# Altium schematic sheet KeyBesselEsquematico.SchDoc
size A4
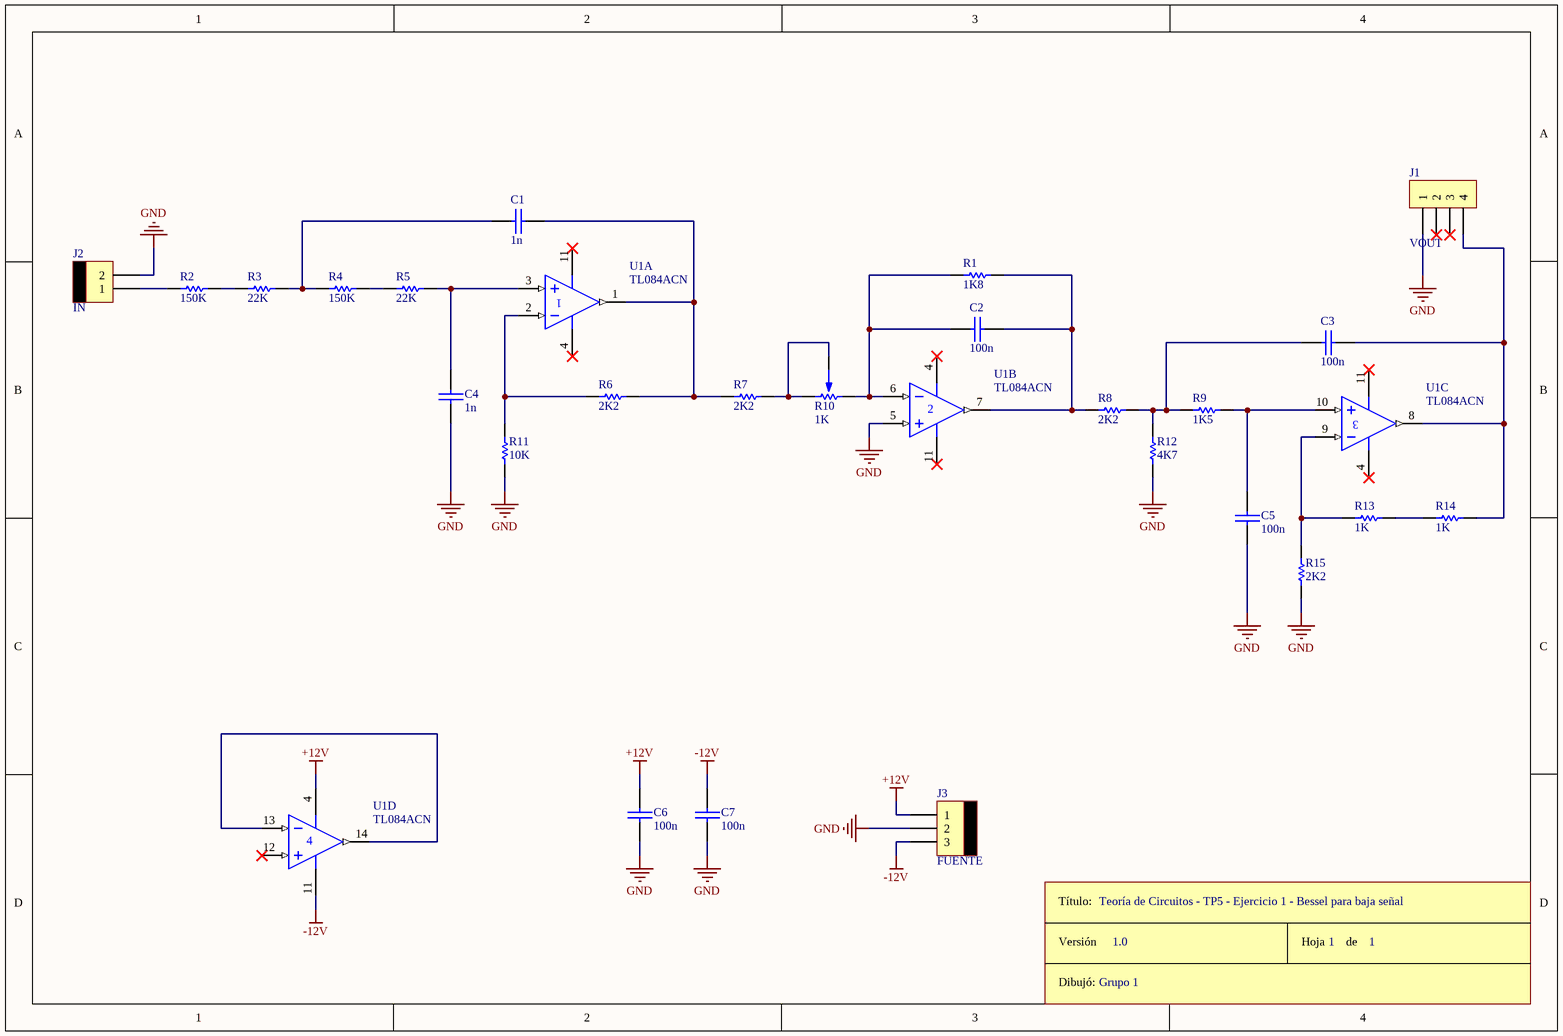
[diagram p0: KeyBesselEsquematico.SchDoc]

## Parts
C1  1n  [CAP100]
C2  100n  [CAP100]
C3  100n  [CAP100]
C4  1n  [CAP100]
C5  100n  [CAP100]
C6  100n  [CAP100]
C7  100n  [CAP100]
J1  VOUT  [SIP4]
J2  IN  [MOLEX2]
J3  FUENTE  [MOLEX3]
R1  1K8  [RES300]
R2  150K  [RES300]
R3  22K  [RES300]
R4  150K  [RES300]
R5  22K  [RES300]
R6  2K2  [RES300]
R7  2K2  [RES300]
R8  2K2  [RES300]
R9  1K5  [RES300]
R10  1K  [PRESET V]
R11  10K  [RES300]
R12  4K7  [RES300]
R13  1K  [RES300]
R14  1K  [RES300]
R15  2K2  [RES300]
ROT1  Rótulo  (value not drawn)
U1  TL084ACN  [646-06]  (parts A,B,C,D of 4)

## Nets
+12V: C6.1 J3.1 U1.4(V+)
-12V: C7.1 J3.3 U1.11(V-)
GND: C4.2 C5.2 C6.2 C7.2 J1.1 J2.2 J3.2 R11.1 R12.1 R15.1 U1.5(IN+)
NetC1_1: C1.1 R3.2 R4.1
NetC1_2: C1.2 R6.2 R7.1 U1.1(OUT)
NetC2_1: C2.1 R1.1 R10.3 U1.6(IN-)
NetC2_2: C2.2 R1.2 R8.1 U1.7(OUT)
NetC3_1: C3.1 R8.2 R9.1 R12.2
NetC3_2: C3.2 J1.4 R14.2 U1.8(OUT)
NetC4_1: C4.1 R5.2 U1.3(IN+)
NetC5_1: C5.1 R9.2 U1.10(IN+)
NetJ2_1: J2.1 R2.1
NetR2_2: R2.2 R3.1
NetR4_2: R4.2 R5.1
NetR6_1: R6.1 R11.2 U1.2(IN-)
NetR7_2: R7.2 R10.1 R10.2
NetR13_1: R13.1 R15.2 U1.9(IN-)
NetR13_2: R13.2 R14.1
NetU1_13: U1.13(IN-) U1.14(OUT)

Not connected (* = marked no-connect by the designer): J1 2* 3*; U1 12(IN+)*

## Notes on the sheet
- Teoría de Circuitos - TP5 - Ejercicio 1 - Bessel para baja señal
- Grupo 1
- 1.0
- 1
- (in symbol Rótulo) Título:; Versión; Hoja       de; Dibujó:

## Library data of the parts
C1-C7 = CAP
J1 = CON4
J2 = MOLEX2
J3 = MOLEX3
R1-R9 R11-R15 = RES
R10 = PRESET
U1 = TL084ACN: JFET-Input Operational Amplifier; Published: 17-Jul-2002; LatestRevisionDate: 06-Jun-2005; LatestRevisionNote: Stylized 3D Model Added.; DatasheetVersion: 1988; PackageVersion: 1997; PackageReference: 646-06; Publisher: Altium Limited; PackageDescription: DIP; 14 Leads; Row Spacing 7.62 mm; Pitch 2.54 mm; ComponentLink1Description: Manufacturer Link; ComponentLink1URL: http://www.onsemi.com/site/products/parametrics/0,4446,251,00.html